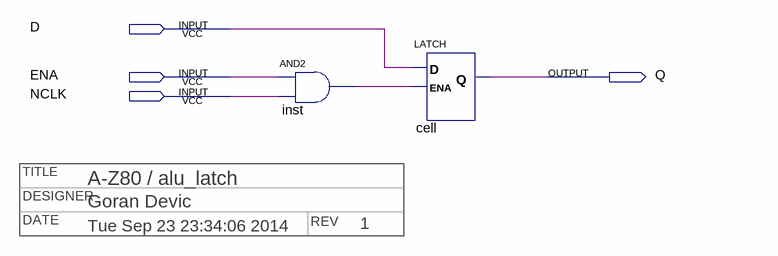
[diagram p0: schematic sheet]
// Quartus schematic alu_latch.bdf as structural Verilog: 2 symbols, 4 pins
// Title block: TITLE: A-Z80 / alu_latch; DESIGNER: Goran Devic; DATE: Tue Sep 23 23:34:06 2014; REV: 1
module alu_latch (
  input  D,
  input  ENA,
  input  NCLK,
  output Q
);

  wire inst_out;

  and inst (inst_out, ENA, NCLK);
  LATCH \cell  (.D(D), .ENA(inst_out), .Q(Q));
endmodule
